# EAGLE design berlingo synth 0.6 (EAGLE 6.6.0)
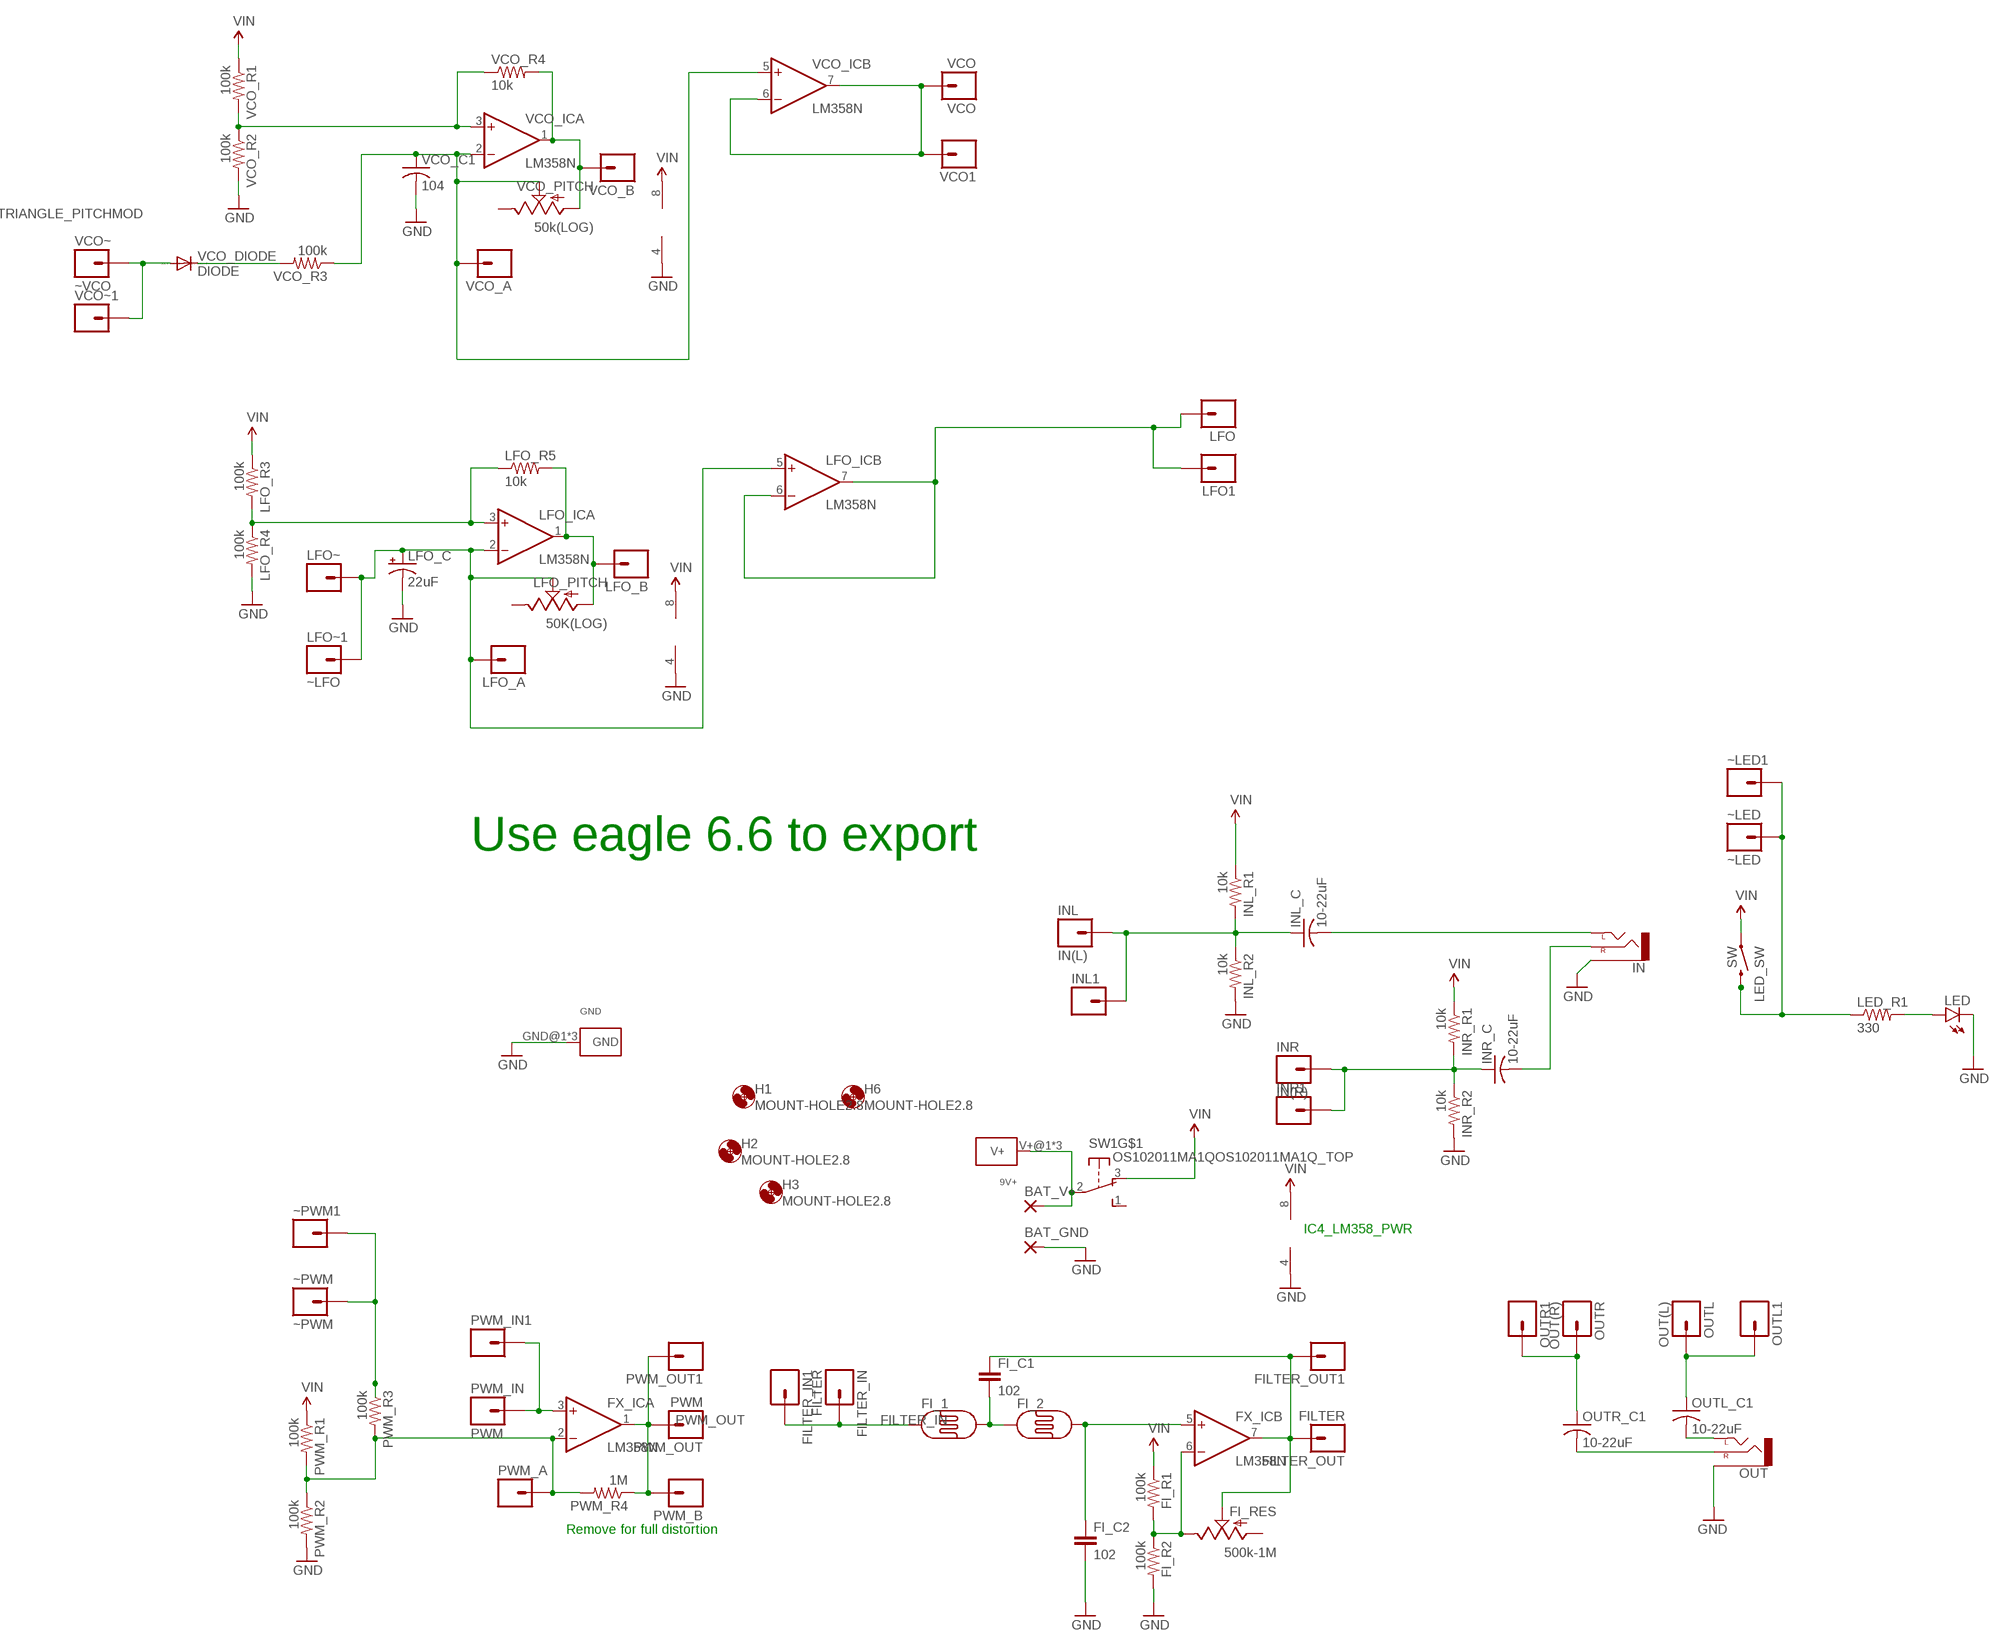
[diagram p0: schematic, sheet 1]

## Parts
9V+  KEYSTONE-629+  [KEYSTONE_BATTAERY_TERMINAL-629+]
BAT_GND  3,81/1,4  [3,81/1,4]
BAT_V+  3,81/1,4  [3,81/1,4]
FI_1  PHOTOCELLPTH  [PHOTOCELL]
FI_2  PHOTOCELLPTH  [PHOTOCELL]
FI_C1  102  CAPEZ  [CAP-PTH-SMALLEZ]
FI_C2  102  CAPEZ  [CAP-PTH-SMALLEZ]
FI_R1  100k  R-US_0207/10  [0207/10]
FI_R2  100k  R-US_0207/10  [0207/10]
FI_RES  500k-1M  POT  [ALPS_POT]
FILTER_IN  FILTER  HEADER-1X1  [1X01_SIDE_NAME]
FILTER_IN1  HEADER-1X1  [1X01_SIDE_NAME]
FILTER_OUT  FILTER  HEADER-1X1  [1X01_SIDE_NAME]
FILTER_OUT1  HEADER-1X1  [1X01_SIDE_NAME]
FX_IC  LM358N  [DIL08]
GND  KEYSTONE-629  [KEYSTONE_AA_AAA_BATTERY_TERMINAL-629]
H1  MOUNT-HOLE2.8  [2,8]
H2  MOUNT-HOLE2.8  [2,8]
H3  MOUNT-HOLE2.8  [2,8]
H6  MOUNT-HOLE2.8  [2,8]
IN  AUDIO-JACKPTH  [AUDIO-JACK]
INL  IN(L)  HEADER-1X1  [1X01_SIDE_NAME]
INL1  HEADER-1X1  [1X01_SIDE_NAME]
INL_C  10-22uF  C-US050-024X044  [C050-024X044]
INL_R1  10k  R-US_0207/10  [0207/10]
INL_R2  10k  R-US_0207/10  [0207/10]
INR  IN(R)  HEADER-1X1  [1X01_SIDE_NAME]
INR1  HEADER-1X1  [1X01_SIDE_NAME]
INR_C  10-22uF  C-US050-024X044  [C050-024X044]
INR_R1  10k  R-US_0207/10  [0207/10]
INR_R2  10k  R-US_0207/10  [0207/10]
LED  LED5MM  [LED5MM]
LED_R1  330  R-US_0207/10  [0207/10]
LED_SW  SW  SWITCH-MOMENTARY-212MM  [TACTILE-PTH-12MM]
LFO  HEADER-1X1  [1X01_SIDE_NAME]
LFO1  HEADER-1X1  [1X01_SIDE_NAME]
LFO_A  HEADER-1X1  [1X01_SIDE_NAME]
LFO_B  HEADER-1X1  [1X01_SIDE_NAME]
LFO_C  22uF  CPOL-USE2.5-6  [E2,5-6]
LFO_IC  LM358N  [DIL08]
LFO_PITCH  50K(LOG)  POT  [ALPS_POT]
LFO_R3  100k  R-US_0207/10  [0207/10]
LFO_R4  100k  R-US_0207/10  [0207/10]
LFO_R5  10k  R-US_0207/10  [0207/10]
LFO~  HEADER-1X1  [1X01_SIDE_NAME]
LFO~1  ~LFO  HEADER-1X1  [1X01_SIDE_NAME]
OUT  AUDIO-JACKPTH  [AUDIO-JACK]
OUTL  OUT(L)  HEADER-1X1  [1X01_SIDE_NAME]
OUTL1  HEADER-1X1  [1X01_SIDE_NAME]
OUTL_C1  10-22uF  C-US050-024X044  [C050-024X044]
OUTR  OUT(R)  HEADER-1X1  [1X01_SIDE_NAME]
OUTR1  HEADER-1X1  [1X01_SIDE_NAME]
OUTR_C1  10-22uF  C-US050-024X044  [C050-024X044]
PWM_A  HEADER-1X1  [1X01_SIDE_NAME]
PWM_B  HEADER-1X1  [1X01_SIDE_NAME]
PWM_IN  PWM  HEADER-1X1  [1X01_SIDE_NAME]
PWM_IN1  HEADER-1X1  [1X01_SIDE_NAME]
PWM_OUT  PWM  HEADER-1X1  [1X01_SIDE_NAME]
PWM_OUT1  HEADER-1X1  [1X01_SIDE_NAME]
PWM_R1  100k  R-US_0207/10  [0207/10]
PWM_R2  100k  R-US_0207/10  [0207/10]
PWM_R3  100k  R-US_0207/10  [0207/10]
PWM_R4  1M  R-US_0207/10  [0207/10]
SW1  OS102011MA1QOS102011MA1Q_TOP  [OS102011MA1Q]
VCO  VCO  HEADER-1X1  [1X01_SIDE_NAME]
VCO1  HEADER-1X1  [1X01_SIDE_NAME]
VCO_A  HEADER-1X1  [1X01_SIDE_NAME]
VCO_B  HEADER-1X1  [1X01_SIDE_NAME]
VCO_C1  104  C-US050-024X044  [C050-024X044]
VCO_DIODE  DIODE  1N4004  [DO41-10]
VCO_IC  LM358N  [DIL08]
VCO_PITCH  50k(LOG)  POT  [ALPS_POT]
VCO_R1  100k  R-US_0207/10  [0207/10]
VCO_R2  100k  R-US_0207/10  [0207/10]
VCO_R3  100k  R-US_0207/10  [0207/10]
VCO_R4  10k  R-US_0207/10  [0207/10]
VCO~  ~VCO  HEADER-1X1  [1X01_SIDE_NAME]
VCO~1  HEADER-1X1  [1X01_SIDE_NAME]
~LED  ~LED  HEADER-1X1  [1X01_SIDE_NAME]
~LED1  HEADER-1X1  [1X01_SIDE_NAME]
~PWM  ~PWM  HEADER-1X1  [1X01_SIDE_NAME]
~PWM1  HEADER-1X1  [1X01_SIDE_NAME]

## Nets
FILTER_IN: FI_1.1 FILTER_IN1.1 FILTER_IN.1
FILTER_OUT: FI_C1.1 FI_RES.P$2(S) FILTER_OUT1.1 FILTER_OUT.1 FX_IC.7(B:OUT)
GND: BAT_GND.1(P) FI_C2.2 FI_R2.2 FX_IC.4(P:V-) GND.GND@1(GND) GND.GND@2(GND) GND.GND@3(GND) IN.SLEEVE INL_R2.2 INR_R2.2 LED.K(C) LFO_C.- LFO_IC.4(P:V-) LFO_R4.2 OUT.SLEEVE PWM_R2.2 VCO_IC.4(P:V-) VCO_R2.2
LFO: LFO1.1 LFO.1 LFO_IC.6(B:-IN) LFO_IC.7(B:OUT)
MOD_IN: FX_IC.3(A:+IN) PWM_IN1.1 PWM_IN.1
N$1: 9V+.V+@1(V+) 9V+.V+@2(V+) 9V+.V+@3(V+) BAT_V+.1(P) SW1.2(P)
N$2: VCO_DIODE.C VCO_R3.2
N$3: FX_IC.2(A:-IN) PWM_A.1 PWM_R1.2 PWM_R2.1 PWM_R3.2 PWM_R4.2
N$4: VCO_IC.3(A:+IN) VCO_R1.2 VCO_R2.1 VCO_R4.1
N$5: PWM_R3.1 ~PWM1.1 ~PWM.1
N$6: LED.A LED_R1.2
N$7: FI_2.2 FI_C2.1 FX_IC.5(B:+IN)
N$8: FI_1.2 FI_2.1 FI_C1.2
N$9: OUTR1.1 OUTR.1 OUTR_C1.1
N$10: VCO_B.1 VCO_IC.1(A:OUT) VCO_PITCH.P$3(A) VCO_R4.2
N$11: OUT.TIP(LEFT) OUTL_C1.2
N$12: OUTL1.1 OUTL.1 OUTL_C1.1
N$13: LED_R1.1 LED_SW.3 ~LED1.1 ~LED.1
N$14: INR1.1 INR.1 INR_C.1 INR_R1.2 INR_R2.1
N$15: IN.RING(RIGHT) INR_C.2
N$16: FI_R1.2 FI_R2.1 FI_RES.P$1(E) FX_IC.6(B:-IN)
N$17: LFO_IC.3(A:+IN) LFO_R3.2 LFO_R4.1 LFO_R5.1
N$18: VCO_A.1 VCO_C1.1 VCO_IC.2(A:-IN) VCO_IC.5(B:+IN) VCO_PITCH.P$2(S) VCO_R3.1
N$19: INL1.1 INL.1 INL_C.1 INL_R1.2 INL_R2.1
N$20: IN.TIP(LEFT) INL_C.2
N$21: LFO_B.1 LFO_IC.1(A:OUT) LFO_PITCH.P$3(A) LFO_R5.2
N$22: LFO_A.1 LFO_C.+ LFO_IC.2(A:-IN) LFO_IC.5(B:+IN) LFO_PITCH.P$2(S) LFO~1.1 LFO~.1
N$23: VCO1.1 VCO.1 VCO_IC.6(B:-IN) VCO_IC.7(B:OUT)
N$24: OUT.RING(RIGHT) OUTR_C1.2
PWM_OUT: FX_IC.1(A:OUT) PWM_B.1 PWM_OUT1.1 PWM_OUT.1 PWM_R4.1
TRIANGLE_PITCHMOD: VCO_DIODE.A VCO~1.1 VCO~.1
VIN: FI_R1.1 FX_IC.8(P:V+) INL_R1.1 INR_R1.1 LED_SW.1 LFO_IC.8(P:V+) LFO_R3.1 PWM_R1.1 SW1.3(O) VCO_IC.8(P:V+) VCO_R1.1
Unconnected: FI_RES.P$3(A) LFO_PITCH.P$1(E) SW1.1(S) SW1.MT1(MT) SW1.MT2(MT) VCO_C1.2 VCO_PITCH.P$1(E)

## Notes on the sheet
- Use eagle 6.6 to export
- IC4_LM358_PWR
- Remove for full distortion

## Library data of the parts
9V+ = kanflo:KEYSTONE-629+
BAT_GND BAT_V+ = wirepad:3,81/1,4: THROUGH-HOLE PAD
FI_1 FI_2 = SparkFun-Sensors:PHOTOCELL: CdS photoresistor. This is a low cost way to detect light levels. Resistance decreases with more incoming light. SparkFun SKU: SEN-09088
FI_C1 FI_C2 = SparkFun-Capacitors:CAP: Capacitor Standard 0603 ceramic capacitor, and 0.1" leaded capacitor.
FI_R1 FI_R2 INL_R1 INL_R2 INR_R1 INR_R2 LED_R1 LFO_R3-LFO_R5 PWM_R1-PWM_R4 VCO_R1-VCO_R4 = resistor:R-US_: RESISTOR, American symbol
FI_RES LFO_PITCH VCO_PITCH = SparkFun-Electromechanical:POT; PROD_ID: RES-09177
FILTER_IN FILTER_IN1 FILTER_OUT FILTER_OUT1 INL INL1 INR INR1 LFO LFO1 LFO_A LFO_B LFO~ LFO~1 OUTL OUTL1 OUTR OUTR1 PWM_A PWM_B PWM_IN PWM_IN1 PWM_OUT PWM_OUT1 VCO VCO1 VCO_A VCO_B VCO~ VCO~1 ~LED ~LED1 ~PWM ~PWM1 = TOF:HEADER-1X1: Header 1 Standard 1-pin 0.1" header. Use with straight break away headers (SKU : PRT-00116), right angle break away headers (PRT-00553), swiss pins (PRT-00743), machine pins (PRT-00117), and female headers (PRT-00115).
FX_IC LFO_IC VCO_IC = linear:LM358: OP AMP also LM158; LM258; LM2904 Source: http://cache.national.com/ds/LM/LM158.pdf
GND = kanflo:KEYSTONE-629: Keystone 629 PCB Mount Battery Contact for 1 (AA), 1 (AAA), 1 (N), Coil Spring Contact Links Data sheet <http://docs-europe.electrocomponents.com/webdocs/002e/0900766b8002ef6f.pdf> RS Online <http://se.rs-online.com/web/p/battery-holders-mounts/2050057/>
H1-H3 H6 = holes:MOUNT-HOLE: MOUNTING HOLE with drill center marker
IN OUT = SparkFun-Connectors:AUDIO-JACK: 3.5mm Audio Jack Simple 3.5mm common PCB mount audio jack. Variant PTH is our storefront SKU PRT-08032
INL_C INR_C OUTL_C1 OUTR_C1 VCO_C1 = adafruit:C-US: CAPACITOR, American symbol
LED = SparkFun-LED:LED: LEDs Standard schematic elements and footprints for 5mm, 3mm, 1206, and 0603 sized LEDs. 5mm - Spark Fun Electronics SKU : COM-00529 (and others)
LED_SW = SparkFun-Electromechanical:SWITCH-MOMENTARY-2: Various NO switches- pushbuttons, reed, etc; PROD_ID: SWCH-09185
LFO_C = rcl:CPOL-US: POLARIZED CAPACITOR, American symbol
SW1 = TOF:OS102011MA1Q: OS10201MA1Q through-hole right angle switch http://www.ladyada.net/library/eagle
VCO_DIODE = diode:1N4004: DIODE general purpose rectifier, 1 A

## Board
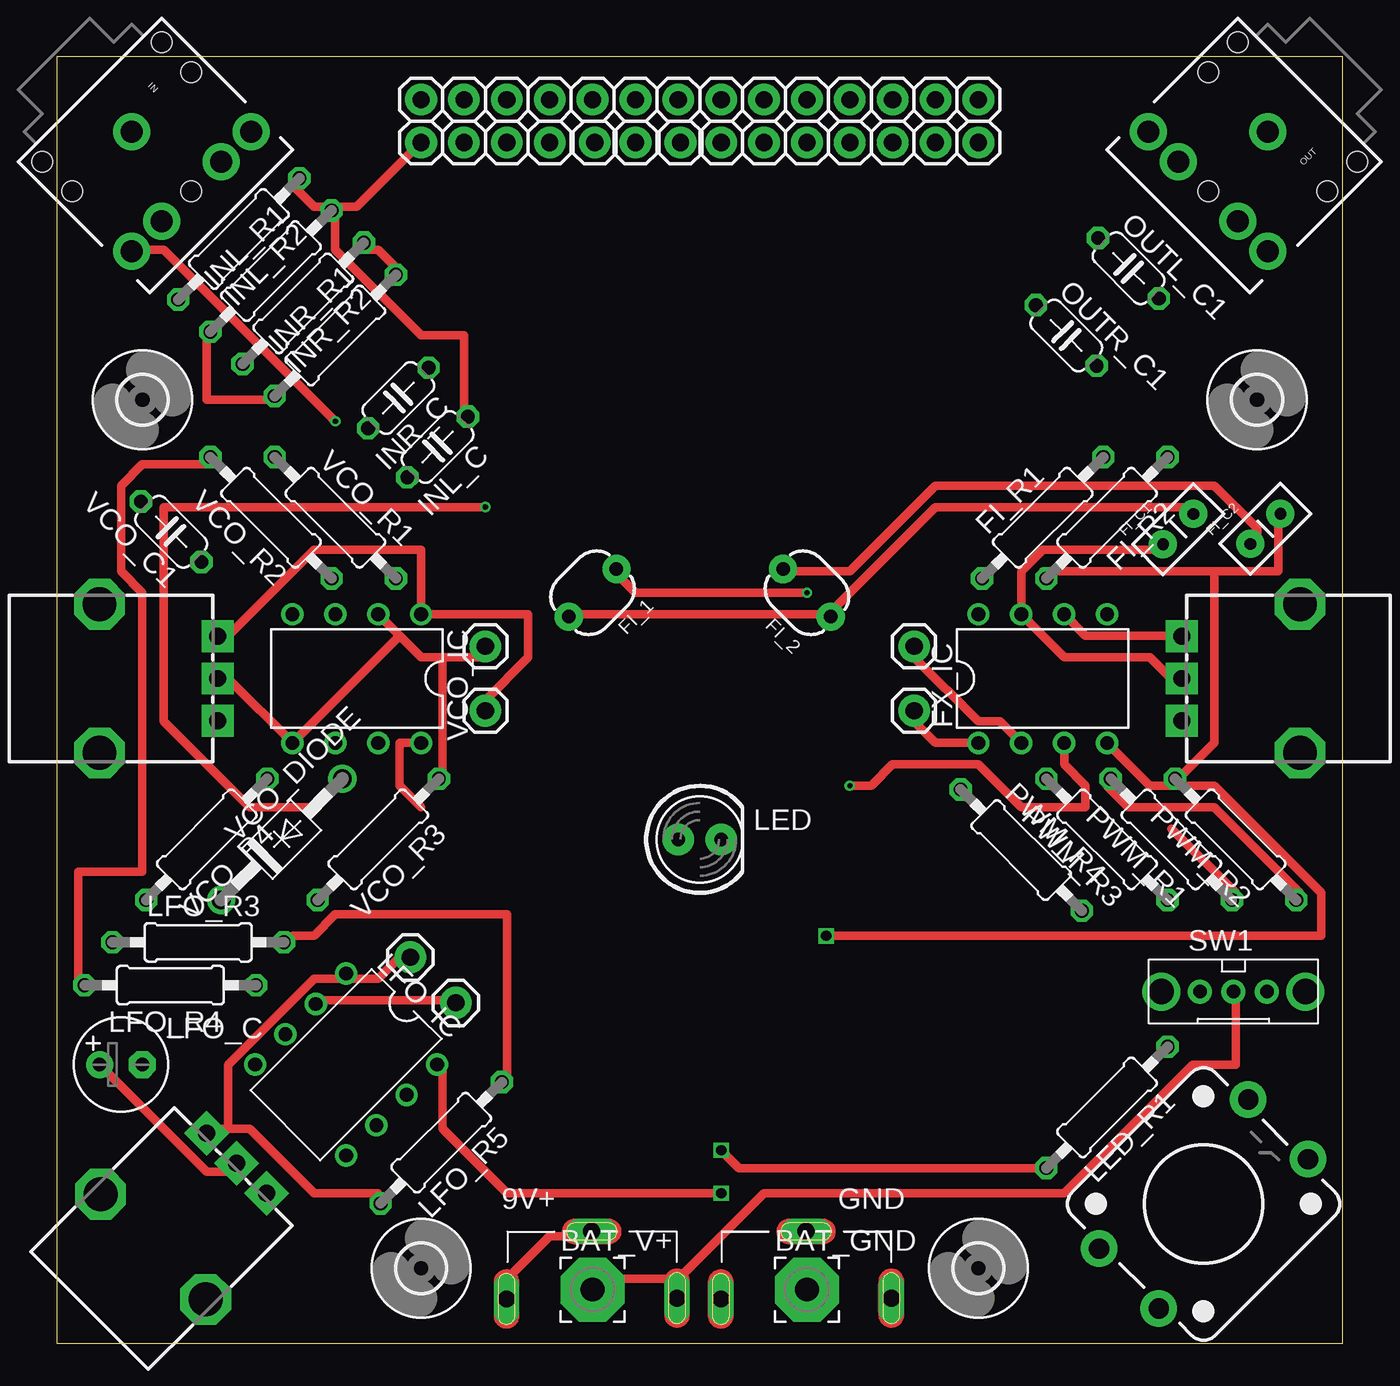
[diagram p1: board, top side]
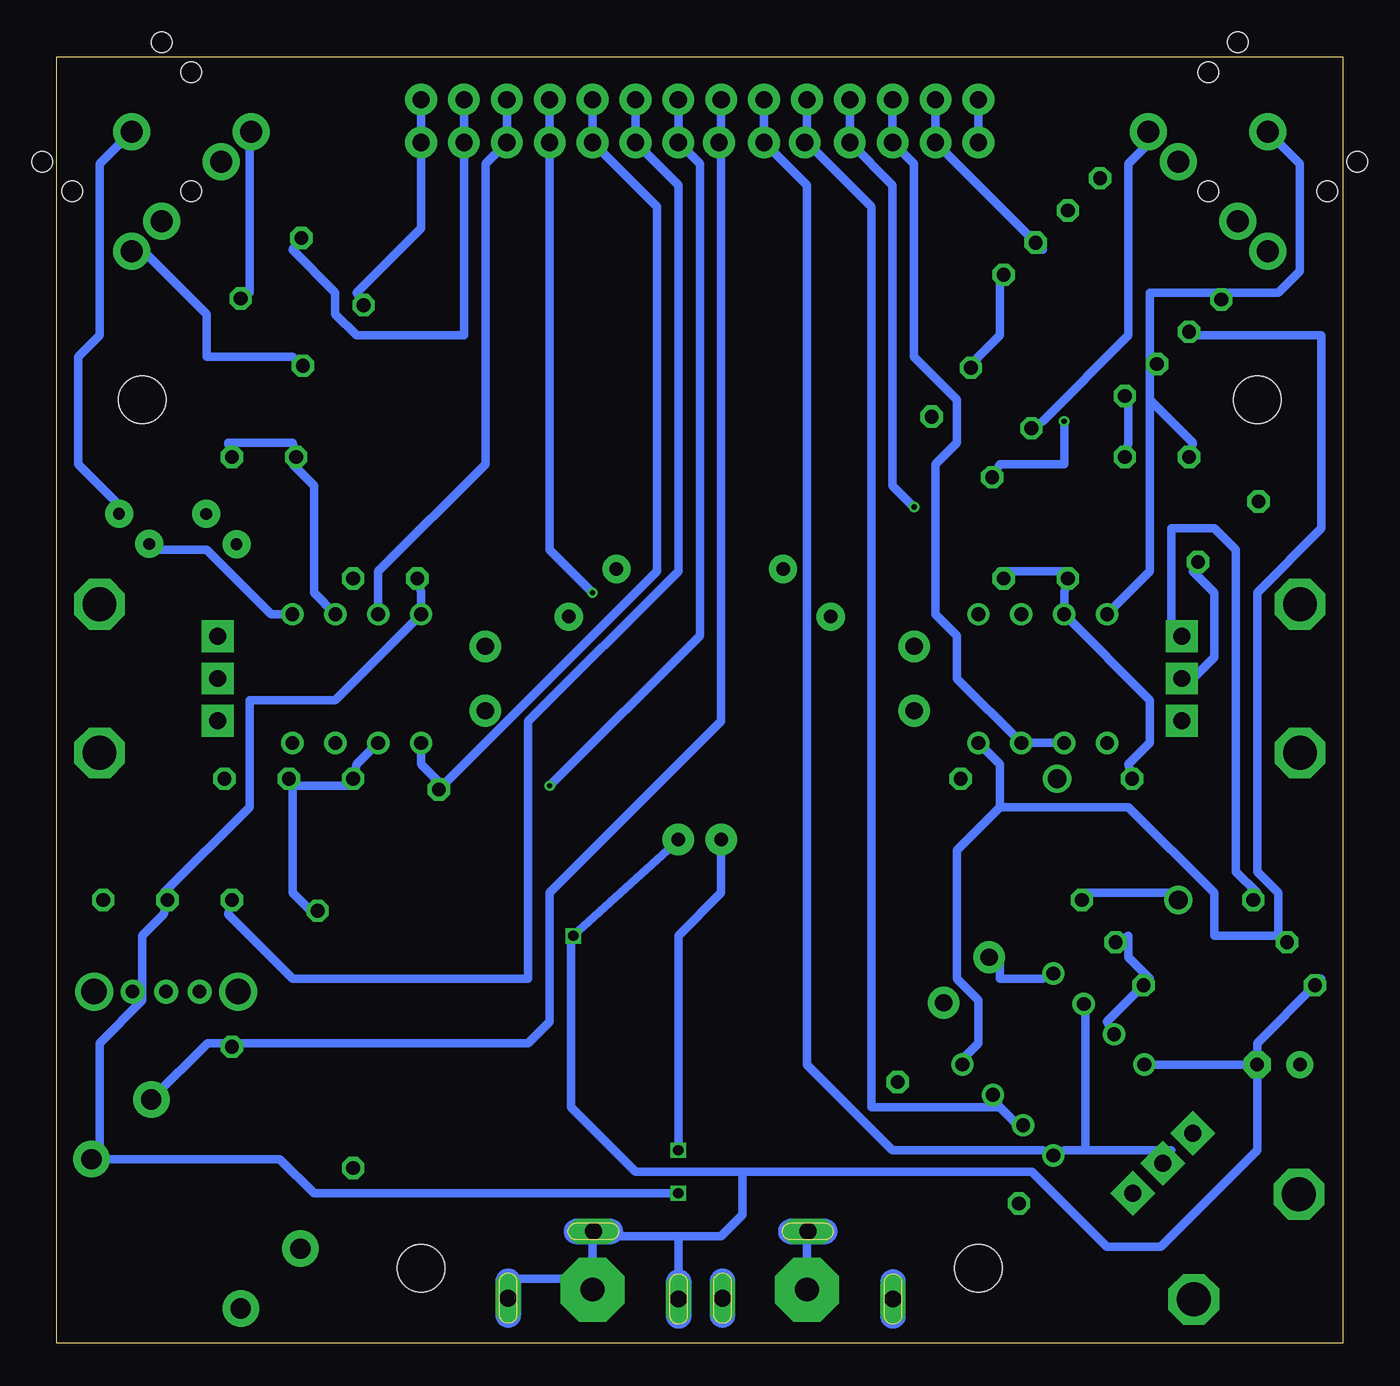
[diagram p2: board, bottom side, seen from below]

Size 76.2 x 76.2 mm. Coordinates in mm from the lower left corner, seen from the top.
Outline: 0,0 76.2,0 76.2,76.2 0,76.2 0,0
Copper layers (1*16): Top 0.035mm / dielectric 1.5mm / Bottom 0.035mm
Design rules "EagleRules *": minimum track width 20mil, minimum drill 12mil, track to track 7mil, track to pad 7mil, pad to pad 6mil, via to via 7mil, smd to smd 0mil, copper to edge 20mil, drill to drill 10mil, minimum pad ring 10mil, minimum via ring 6mil, stop-mask expansion 2mil, vias tented up to drill 25mil, thermal gap 10mil

### Footprints (pad centres in the part's own frame; a part is rotated, then mirrored left to right if it is on the bottom)
KEYSTONE_BATTAERY_TERMINAL-629+ = drill 1 pad 1.5 long: V+@1 5,-0.5; V+@2 -0.05,3.45; V+@3 -5.1,-0.55
3,81/1,4 = drill 1.397 pad 3.81 octagon: 1 0,0
PHOTOCELL = drill 0.8 pad 1.676: 1 -2,0; 2 2,0
CAP-PTH-SMALLEZ = drill 0.7 pad 1.651: 1 0,0; 2 2.54,0
0207/10 = drill 0.813 octagon: 1 -5.08,0; 2 5.08,0
ALPS_POT = drill 1 pad 1.88 square: P$1 7,-2.5; P$2 7,0; P$3 7,2.5 | drill 2 octagon: P$4 0,-4.4; P$5 0,4.4
1X01_SIDE_NAME = drill 1.016 pad 1.88: 1 0,0
DIL08 = drill 0.813 pad 1.27: 1 -3.81,-3.81; 2 -1.27,-3.81; 3 1.27,-3.81; 4 3.81,-3.81; 5 3.81,3.81; 6 1.27,3.81; 7 -1.27,3.81; 8 -3.81,3.81
KEYSTONE_AA_AAA_BATTERY_TERMINAL-629 = drill 1 pad 1.5 long: GND@1 5,-0.5; GND@2 -0.05,3.45; GND@3 -5.1,-0.55
2,8 = hole 2.8: 0,0
AUDIO-JACK = drill 1.3 pad 2.184: RING 5,5; RSH 5,2.5; SLEEVE 0,0; TIP 5,-5; TSH 5,-2.5 | hole 1.2: 0,5; -2.5,5; -2.5,-5; 0,-5; 5,0
C050-024X044 = drill 0.813 octagon: 1 -2.54,0; 2 2.54,0
LED5MM = drill 0.813 pad 1.88: A -1.27,0; K 1.27,0
TACTILE-PTH-12MM = drill 1.2 pad 2.159: 1 6.25,-2.5; 2 -6.25,-2.5; 3 6.25,2.5; 4 -6.25,2.5
E2,5-6 = drill 0.813 pad 1.6: + -1.27,0 | drill 0.813 pad 1.6 octagon: - 1.27,0
OS102011MA1Q = drill 0.8 pad 1.422: 1 -1.981,0; 2 0,0; 3 1.981,0 | drill 1.5 pad 2.184: MT1 -4.267,0; MT2 4.267,0
DO41-10 = drill 1.118: A 5.08,0; C -5.08,0

### Placement (x,y rotation side)
9V+  31.75,3.17 0 top
BAT_GND  44.45,3.17 0 top
BAT_V+  31.75,3.17 0 top
FI_1  31.75,44.45 225 top
FI_2  44.45,44.45 135 top
FI_C1  65.55,47.32 45 top
FI_C2  70.71,47.34 45 top
FI_R1  58.42,48.9 45 top
FI_R2  62.23,48.9 225 top
FI_RES  73.66,39.37 180 top
FILTER_IN  46.99,71.12 270 top
FILTER_IN1  46.99,73.66 90 top
FILTER_OUT  49.53,71.12 270 top
FILTER_OUT1  49.53,73.66 90 top
FX_IC  58.42,39.37 0 top
GND  44.45,3.17 0 top
H1  71.12,55.88 0 top
H2  21.59,4.45 0 top
H3  54.61,4.45 0 top
H6  5.08,55.88 0 top
IN  4.45,71.75 315 top
INL  21.59,71.12 270 top
INL1  21.59,73.66 90 top
INL_C  22.56,53.09 225 top
INL_R1  12.7,63.5 45 top
INL_R2  10.79,65.41 225 top
INR  24.13,71.12 270 top
INR1  24.13,73.66 90 top
INR_C  20.24,55.99 225 top
INR_R1  16.51,59.69 45 top
INR_R2  14.61,61.59 225 top
LED  38.1,29.84 0 top
LED_R1  62.23,13.97 225 top
LED_SW  67.94,8.26 45 top
LFO  31.88,71.12 270 top
LFO1  31.75,73.66 0 top
LFO_A  23.65,20.17 135 top
LFO_B  20.95,22.86 135 top
LFO_C  3.81,16.51 0 top
LFO_IC  17.14,16.51 225 top
LFO_PITCH  5.71,5.71 45 top
LFO_R3  8.38,23.75 0 top
LFO_R4  6.73,21.21 180 top
LFO_R5  22.78,11.88 225 top
LFO~  34.29,73.66 90 top
LFO~1  34.29,71.12 270 top
OUT  71.75,71.75 225 top
OUTL  52.07,71.12 270 top
OUTL1  52.07,73.66 90 top
OUTL_C1  63.5,63.67 315 top
OUTR  54.61,71.12 270 top
OUTR1  54.61,73.66 90 top
OUTR_C1  59.82,59.69 315 top
PWM_A  50.8,41.27 0 top
PWM_B  50.8,37.47 0 top
PWM_IN  39.37,71.12 270 top
PWM_IN1  39.37,73.66 90 top
PWM_OUT  44.45,71.12 270 top
PWM_OUT1  44.45,73.66 90 top
PWM_R1  66.04,29.84 135 top
PWM_R2  69.85,29.84 135 top
PWM_R3  62.23,29.84 135 top
PWM_R4  57.15,29.21 315 top
SW1  69.72,20.83 0 top
VCO  26.67,71.12 270 top
VCO1  26.67,73.66 90 top
VCO_A  25.4,41.27 0 top
VCO_B  25.4,37.47 0 top
VCO_C1  6.78,48.07 135 top
VCO_DIODE  13.34,29.84 45 top
VCO_IC  17.78,39.37 180 top
VCO_PITCH  2.54,39.37 0 top
VCO_R1  16.51,48.9 315 top
VCO_R2  12.7,48.9 135 top
VCO_R3  19.05,29.84 225 top
VCO_R4  8.89,29.84 225 top
VCO~  29.21,71.12 270 top
VCO~1  29.21,73.66 90 top
~LED  36.96,71.12 270 top
~LED1  36.83,73.66 90 top
~PWM  41.91,71.12 270 top
~PWM1  41.91,73.66 90 top

### Tracks (layer width: path | path; a pad name or v marks a point on that pad's centre or on a via)
FILTER_IN  (via drill 0.3)
  Top 0.508: v44.45,44.45 34.29,44.45 33.02,45.72 FI_1.1
  Bottom 0.508: v44.45,44.45 46.99,46.99 FILTER_IN.1 FILTER_IN1.1
FILTER_OUT
  Top 0.508: FI_C1.1 64.77,46.99 58.42,46.99 57.15,45.72 FX_IC.7 59.69,40.64 64.77,40.64 66.04,39.37 FI_RES.P$2
  Bottom 0.508: FILTER_OUT1.1 FILTER_OUT.1 50.8,69.85 50.8,52.07 57.15,45.72 FX_IC.7
GND  (via drill 0.6)
  Top 0.508: FX_IC.4 64.77,33.02 66.04,33.02 | 68.58,45.72 58.42,45.72 FI_R2.2 | 68.58,45.72 72.39,45.72 72.39,49.53 FI_C2.2 | 66.04,33.02 68.58,35.56 68.58,45.72 | LFO_R4.2 1.27,21.59 1.27,27.94 5.08,27.94 5.08,44.45 3.81,45.72 3.81,50.8 5.08,52.07 8.89,52.07 VCO_R2.2 | 66.04,33.02 68.58,33.02 74.93,26.67 74.93,24.13 v45.59,24.13 | 66.04,33.02 PWM_R2.2
  Bottom 0.508: OUT.SLEEVE 73.66,69.85 73.66,59.69 74.93,58.42 74.93,52.07 72.39,49.53 FI_C2.2 | 11.43,55.88 8.89,53.34 VCO_R2.2 | 11.43,58.42 11.43,55.88 | VCO_IC.4 11.43,45.72 11.43,55.88 | 7.62,62.23 11.43,62.23 11.43,58.42 | 11.43,58.42 INR_R2.2 | IN.SLEEVE 2.54,69.85 2.54,63.5 3.81,62.23 7.62,62.23 | 7.62,62.23 INL_R2.2 | LFO_IC.4 LFO_C.- | LFO_C.- 5.08,17.78 LFO_R4.2 1.27,21.59 | 44.45,3.81 44.45,6.35 GND.GND@2 | 44.45,3.81 49.53,3.81 GND.GND@1 | 44.45,3.81 BAT_GND.1 | GND.GND@3 39.37,3.81 39.37,6.35 | 43.18,6.35 GND.GND@2 | LED.K 40.01,29.21 v45.59,24.13 45.72,24 45.72,13.97 41.91,10.16 35.56,10.16 | 35.56,10.16 18.41,10.16 13.97,5.71 10.79,5.71 5.08,11.43 LFO_C.- | GND.GND@2 44.12,6.35 39.37,6.35 | 39.37,6.35 36.83,6.35 35.56,7.62 35.56,10.16
LFO
  Bottom 0.508: 20.32,13.97 19.05,12.7 LFO_IC.6 | LFO1.1 31.75,71.12 | 20.32,13.97 27.94,13.97 27.94,67.31 31.75,71.12 | 20.32,13.97 LFO_IC.7 | 31.75,71.12 LFO.1
MOD_IN  (via drill 0.3)
  Top 0.508: FX_IC.3 59.69,34.29 60.96,33.02 60.96,31.75 57.15,31.75 54.61,34.29 49.53,34.29 48.26,33.02 v46.99,33.02
  Bottom 0.508: v46.99,33.02 38.1,41.91 38.1,69.85 PWM_IN.1 PWM_IN1.1
N$1
  Top 0.508: 9V+.V+@3 26.67,3.81 29.21,6.35 30.48,6.35 9V+.V+@2 | 36.83,3.81 41.91,8.89 59.69,8.89 67.31,16.51 69.85,16.51 69.85,20.32 SW1.2 | 36.83,3.81 31.75,3.81 BAT_V+.1 | 36.83,3.81 9V+.V+@1
  Bottom 0.508: BAT_V+.1 31.75,6.35 9V+.V+@2
N$2
  Bottom 0.508: VCO_R3.2 15.24,26.67 10.16,26.67 VCO_DIODE.C
N$3
  Top 0.508: FX_IC.2 55.88,36.83 54.61,36.83 50.8,40.64 PWM_A.1 | PWM_R2.1 73.66,26.67 68.58,31.75 63.5,31.75 62.23,33.02 PWM_R1.2
  Bottom 0.508: FX_IC.2 58.42,34.29 PWM_R3.2 58.42,33.02 62.23,33.02 | 62.23,33.02 62.23,26.67 60.96,25.4 PWM_R4.2 | 62.23,33.02 PWM_R1.2
N$4
  Bottom 0.508: VCO_R4.1 12.7,34.29 11.43,35.56 11.43,38.1 VCO_IC.3 16.51,44.45 VCO_R2.1 16.51,45.72 20.32,45.72 VCO_R1.2
N$5
  Bottom 0.508: PWM_R3.1 66.04,25.4 62.23,21.59 48.26,21.59 48.26,36.83 39.37,45.72 39.37,68.58 ~PWM.1 ~PWM1.1
N$6  (via drill 0.6)
  Top 0.508: LED_R1.2 40.42,10.38 v39.37,11.43
  Bottom 0.508: v39.37,11.43 39.37,24.13 36.83,26.67 LED.A
N$7
  Top 0.508: FI_2.2 43.18,45.72 46.99,45.72 52.07,50.8 68.58,50.8 71.12,48.26 71.12,46.99 FI_C2.1
  Bottom 0.508: FX_IC.5 63.5,43.18 67.31,46.99 71.12,46.99 FI_C2.1
N$8
  Top 0.508: 45.72,43.18 52.07,49.53 67.31,49.53 FI_C1.2 | 45.72,43.18 30.48,43.18 FI_1.2 | 45.72,43.18 FI_2.1
N$9
  Bottom 0.508: OUTR_C1.1 58.42,62.23 54.61,66.04 OUTR.1 OUTR1.1
N$10
  Top 0.508: VCO_PITCH.P$3 10.16,41.91 15.24,46.99 21.59,46.99 VCO_IC.1 27.94,43.18 27.94,40.64 25.4,38.1 VCO_B.1
  Bottom 0.508: VCO_R4.2 5.08,26.67 6.35,27.94 6.35,46.99 7.62,48.26 10.16,48.26 10.16,41.91 VCO_PITCH.P$3
N$11
  Bottom 0.508: OUTL_C1.2 64.77,62.23 64.77,71.12 OUT.TIP
N$12
  Bottom 0.508: OUTL_C1.1 62.23,64.77 59.69,62.23 59.69,60.96 58.42,59.69 52.07,59.69 OUTL.1 OUTL1.1
N$13
  Bottom 0.508: ~LED1.1 36.83,71.12 | 36.83,71.12 36.83,36.83 46.99,26.67 46.99,19.05 48.26,17.78 65.6,17.78 LED_R1.1 66.04,17.78 67.26,17.78 LED_SW.3 | 36.83,71.12 ~LED.1
N$14
  Top 0.508: INR_R1.2 20.32,63.5 19.05,64.77 17.78,64.77 INR_R2.1
  Bottom 0.508: INR1.1 INR.1 INR_R2.1 17.78,64.77 | INR_C.1 21.59,58.42 20.32,59.69 20.32,63.5 INR_R1.2
N$15
  Bottom 0.508: INR_C.2 17.78,54.61 12.7,59.69 12.7,69.85 11.43,71.12 IN.RING
N$16
  Top 0.508: FX_IC.6 60.96,41.91 66.04,41.91 FI_RES.P$1
  Bottom 0.508: FI_R2.1 66.04,53.34 62.23,53.34 FI_R1.2 62.23,52.07 60.96,50.8 60.96,44.45 FX_IC.6
N$17
  Top 0.508: LFO_R5.1 26.67,15.24 26.67,25.4 16.51,25.4 15.24,24.13 13.97,24.13 LFO_R3.2
  Bottom 0.508: LFO_R3.2 12.7,24.13 12.7,22.86 11.43,21.59 LFO_R4.1 13.97,19.05 LFO_IC.3
N$18
  Top 0.508: VCO_PITCH.P$2 10.16,39.37 VCO_IC.5 20.32,41.91 | 22.86,40.64 22.86,33.02 VCO_R3.1 | 22.86,40.64 25.4,40.64 VCO_A.1 | 20.32,41.91 21.59,40.64 22.86,40.64 | 20.32,41.91 VCO_IC.2
  Bottom 0.508: VCO_C1.1 8.89,45.72 7.62,44.45 7.62,40.64 8.89,39.37 VCO_PITCH.P$2
N$19
  Top 0.508: 16.51,67.31 16.51,64.77 21.59,59.69 24.13,59.69 24.13,54.61 INL_C.1 | 16.51,67.31 15.24,67.31 13.97,68.58 INL_R2.1 | INL.1 17.78,67.31 16.51,67.31 | 16.51,67.31 INL_R1.2
  Bottom 0.508: INL1.1 INL.1
N$20  (via drill 0.3)
  Top 0.508: v16.51,54.61 6.35,64.77 5.08,64.77 IN.TIP
  Bottom 0.508: v16.51,54.61 16.51,52.07 20.32,52.07 INL_C.2
N$21
  Top 0.508: 10.16,12.7 8.89,12.7 LFO_PITCH.P$3 | 10.16,12.7 11.43,12.7 15.24,8.89 19.05,8.89 LFO_R5.2 | 10.16,12.7 10.16,16.51 15.24,21.59 19.05,21.59 20.32,22.86 LFO_B.1
  Bottom 0.508: LFO_IC.1 17.78,21.59 20.32,21.59 20.32,22.86 LFO_B.1
N$22
  Top 0.508: LFO_IC.2 15.24,20.32 22.86,20.32 LFO_A.1 | LFO_C.+ 8.89,10.16 10.16,10.16 LFO_PITCH.P$2
  Bottom 0.508: LFO~.1 LFO~1.1 31.75,68.58 31.75,16.51 26.67,11.43 17.78,11.43 LFO_IC.5 16.51,11.43 15.24,11.43 | 15.24,11.43 10.16,11.43 LFO_PITCH.P$2 | 15.24,11.43 15.24,20.32 LFO_IC.2
N$23
  Bottom 0.508: VCO_IC.6 VCO_IC.7 22.86,39.37 22.86,41.91 24.13,43.18 24.13,52.07 22.86,53.34 22.86,55.88 25.4,58.42 25.4,69.85 VCO.1 VCO1.1
N$24
  Bottom 0.508: OUTR_C1.2 62.23,58.42 67.31,58.42 67.31,60.96 71.12,64.77 OUT.RING
PWM_OUT
  Top 0.508: FX_IC.1 52.07,35.56 50.8,36.83 PWM_B.1
  Bottom 0.508: PWM_OUT1.1 PWM_OUT.1 40.64,67.31 40.64,45.72 53.34,33.02 | 53.34,33.02 54.61,34.29 FX_IC.1 | 53.34,33.02 PWM_R4.1
TRIANGLE_PITCHMOD  (via drill 0.3)
  Top 0.508: VCO_DIODE.A 15.24,31.75 11.43,31.75 6.35,36.83 6.35,49.53 v25.4,49.53
  Bottom 0.508: VCO~1.1 VCO~.1 26.67,68.58 26.67,50.8 v25.4,49.53
VIN  (via drill 0.6)
  Top 0.508: INL_R1.1 8.89,59.69 8.89,55.88 12.7,55.88 INR_R1.1 | 66.04,30.48 69.85,26.67 PWM_R1.1 | 21.59,31.75 20.32,33.02 20.32,35.56 VCO_IC.8 | v39.37,8.89 26.67,8.89 22.86,12.7 22.86,16.18 LFO_IC.8
  Bottom 0.508: FI_R1.1 54.61,44.45 FX_IC.8 59.69,38.1 64.77,38.1 64.77,31.75 69.85,26.67 PWM_R1.1 69.85,25.4 71.12,24.13 71.12,20.32 | 71.12,20.32 73.66,17.78 73.66,11.43 LED_SW.1 62.98,10.91 60.96,8.89 v39.37,8.89 | 71.12,20.32 SW1.3 | VCO_R1.1 12.7,53.34 12.7,55.88 INR_R1.1 | 3.81,24.13 7.62,24.13 7.62,26.67 12.7,31.75 20.32,31.75 | 20.32,31.75 20.32,34.29 VCO_IC.8 | 20.32,31.75 22.86,29.21 22.86,21.59 21.59,20.32 21.59,17.78 22.86,16.51 LFO_IC.8 | 3.81,24.13 3.81,26.67 5.08,27.94 5.08,44.45 1.27,48.26 1.27,59.69 8.89,59.69 INL_R1.1 | 3.81,24.13 LFO_R3.1

### Text on the board
tValues: IN | OUT | FILTER | RCO | 50K | 200K+ | VCO | PWM | BERLINGO / SYNTH 0.6 | LED | 50K | LFO
Reference: Use eagle 6.6 to export!
200bmp: C:/Users/thoma_000/Downloads/berlingo-caracter2.bmp | C:/Users/thoma_000/Downloads/berlingo-caracter2.bmp | C:/Users/thoma_000/Downloads/berlingo-caracter2.bmp